# Altium schematic sheet WWOL.SchDoc
size A4; SheetNumber: 1; SheetTotal: 1
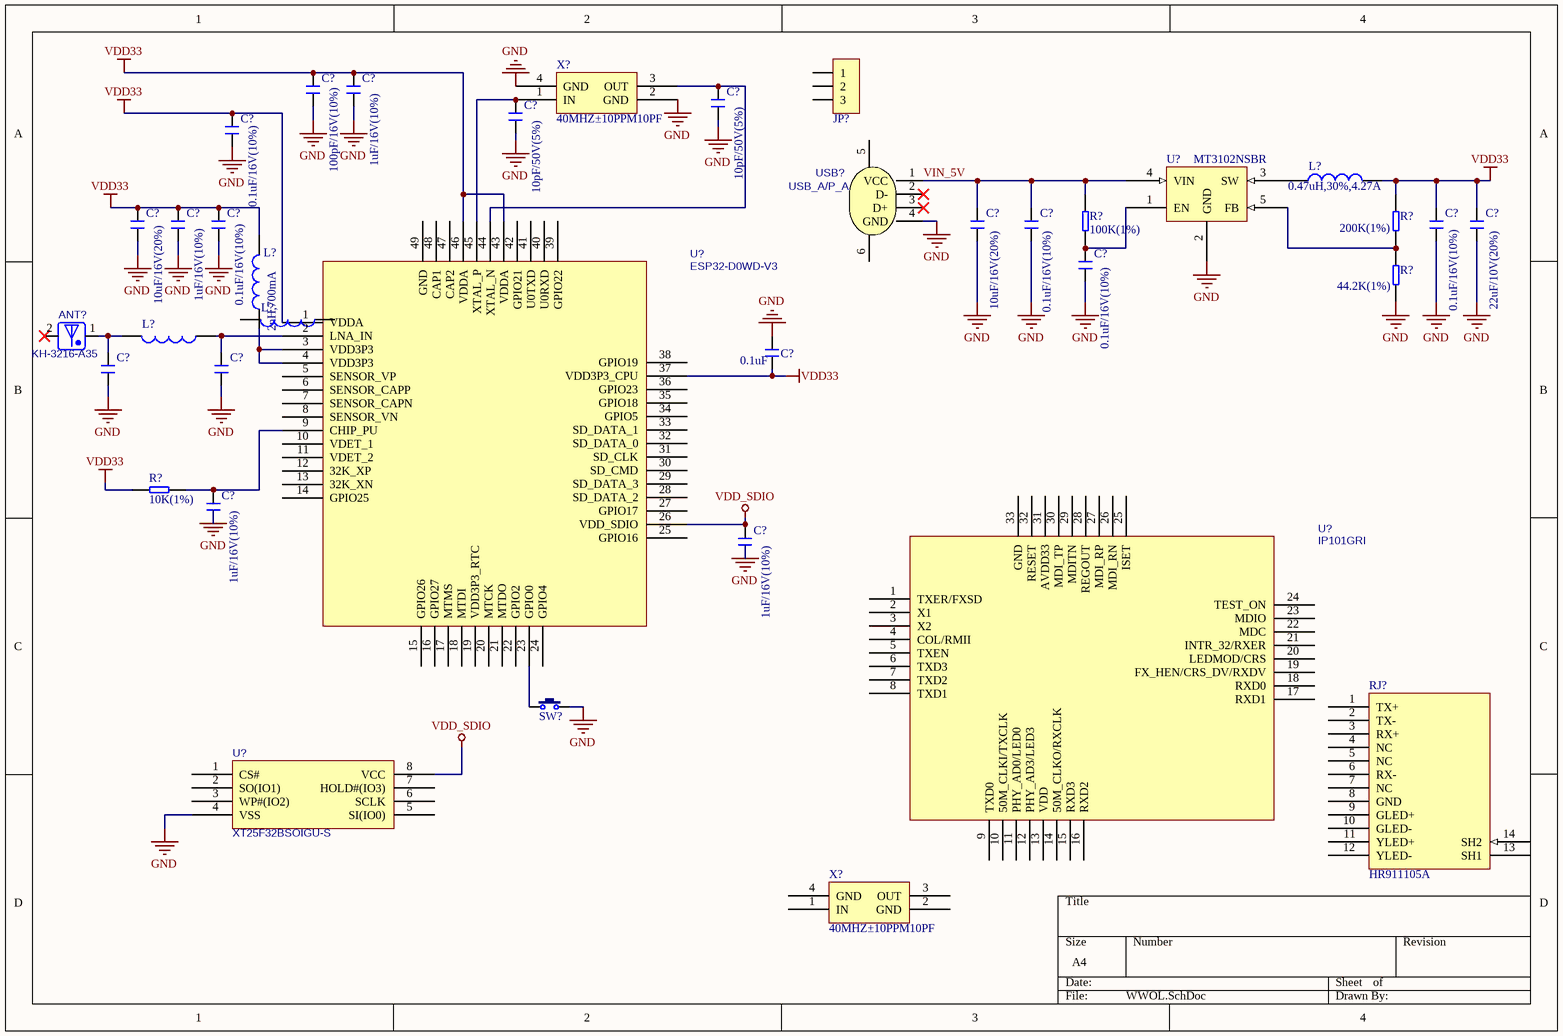
[diagram p0: WWOL.SchDoc]

## Parts
(Parts that share a designator on the sheet are numbered #1, #2 ... from top to bottom, then left to right.)
ANT?  KH-3216-A35  [ANT-SMD-2_L3.2-W1.6-C504002]
C?#1  100pF/16V(10%)  [C0402]
C?#2  1uF/16V(10%)  [C0402]
C?#3  10pF/50V(5%)  [C0402]
C?#4  10pF/50V(5%)  [C0402]
C?#5  0.1uF/16V(10%)  [C0402]
C?#6  10uF/16V(20%)  [C0402]
C?#7  1uF/16V(10%)  [C0402]
C?#8  0.1uF/16V(10%)  [C0402]
C?#9  10uF/16V(20%)  [C0402]
C?#10  0.1uF/16V(10%)  [C0402]
C?#11  0.1uF/16V(10%)  [C0402]
C?#12  22uF/10V(20%)  [C0402]
C?#13  0.1uF/16V(10%)  [C0402]
C?#14  0.1uF  [C0402]
C?#15  (no value)  [C0402]
C?#16  (no value)  [C0402]
C?#17  1uF/16V(10%)  [C0402]
C?#18  1uF/16V(10%)  [C0402]
JP?  HDR-1X3  [HDR2.54-LI-3P]  (value not drawn)
L?#1  0.47uH,30%,4.27A  [L0402]
L?#2  (no value)  [L0402]
L?#3  2nH,700mA  [L0402]
L?#4  (no value)  [L0402]
R?#1  100K(1%)  [R0402]
R?#2  200K(1%)  [R0402]
R?#3  44.2K(1%)  [R0402]
R?#4  10K(1%)  [R0402]
RJ?  HR911105A  [RJ-45A12]
SW?  3x6x5  [TSW SMD-3*6*2.5]  (value not drawn)
U?#1  MT3102NSBR  [SOT95P280X145-5N]
U?#2  ESP32-D0WD-V3  [QFN35P500X500X90_HS-49N]
U?#3  IP101GRI  [QFN35P500X500X90_HS-49N]
U?#4  XT25F32BSOIGU-S  [SOP127P600X175-8N]
USB?  USB_A/P_A  [USB_A/P_A]
X?#1  40MHZ±10PPM10PF  [OSC 1612-4P]
X?#2  40MHZ±10PPM10PF  [OSC 1612-4P]

## Nets
GND: C?#1.1 C?#2.1 C?#3.1 C?#4.1 C?#5.1 C?#6.1 C?#7.1 C?#8.1 C?#9.1 C?#10.1 C?#11.1 C?#12.1 C?#13.1 C?#14.1 C?#15.1 C?#16.1 C?#17.1 C?#18.1 R?#3.1 SW?.2 U?#1.2(GND) U?#4.4(VSS) USB?.4(GND) X?#1.2(GND) X?#1.4(GND)
VDD33: C?#1.2 C?#2.2 C?#5.2 C?#6.2 C?#7.2 C?#8.2 C?#11.2 C?#12.2 C?#14.2 L?#1.2 L?#3.2 R?#2.2 R?#4.2 U?#2.1(VDDA) U?#2.37(VDD3P3_CPU) U?#2.43(VDDA) U?#2.46(VDDA)
VDD_SDIO: C?#18.2 U?#2.26(VDD_SDIO) U?#4.8(VCC)
VIN_5V: C?#9.2 C?#10.2 R?#1.2 U?#1.4(VIN) USB?.1(VCC)
NetANT?_1: ANT?.1 C?#15.2 L?#4.2
NetC?#3_2: C?#3.2 U?#2.44(XTAL_N) X?#1.3(OUT)
NetC?#4_2: C?#4.2 U?#2.45(XTAL_P) X?#1.1(IN)
NetC?#13_2: C?#13.2 R?#1.1 U?#1.1(EN)
NetC?#16_2: C?#16.2 L?#4.1 U?#2.2(LNA_IN)
NetC?#17_2: C?#17.2 R?#4.1 U?#2.9(CHIP_PU)
NetL?#1_1: L?#1.1 U?#1.3(SW)
NetL?#3_1: L?#3.1 U?#2.3(VDD3P3) U?#2.4(VDD3P3)
NetR?#2_1: R?#2.1 R?#3.2 U?#1.5(FB)
NetSW?_1: SW?.1 U?#2.23(GPIO0)

Not connected (* = marked no-connect by the designer): ANT? 2*; JP? 1 2 3; L?#2 1 2; RJ? 1(TX+) 2(TX-) 3(RX+) 4(NC) 5(NC) 6(RX-) 7(NC) 8(GND) 9(GLED+) 10(GLED-) 11(YLED+) 12(YLED-) 13(SH1) 14(SH2); U?#2 5(SENSOR_VP) 6(SENSOR_CAPP) 7(SENSOR_CAPN) 8(SENSOR_VN) 10(VDET_1) 11(VDET_2) 12(32K_XP) 13(32K_XN) 14(GPIO25) 15(GPIO26) 16(GPIO27) 17(MTMS) 18(MTDI) 19(VDD3P3_RTC) 20(MTCK) 21(MTDO) 22(GPIO2) 24(GPIO4) 25(GPIO16) 27(GPIO17) 28(SD_DATA_2) 29(SD_DATA_3) 30(SD_CMD) 31(SD_CLK) 32(SD_DATA_0) 33(SD_DATA_1) 34(GPIO5) 35(GPIO18) 36(GPIO23) 38(GPIO19) 39(GPIO22) 40(U0RXD) 41(U0TXD) 42(GPIO21) 47(CAP2) 48(CAP1) 49(GND); U?#3 1(TXER/FXSD) 2(X1) 3(X2) 4(COL/RMII) 5(TXEN) 6(TXD3) 7(TXD2) 8(TXD1) 9(TXD0) 10(50M_CLKI/TXCLK) 11(PHY_AD0/LED0) 12(PHY_AD3/LED3) 13(VDD) 14(50M_CLKO/RXCLK) 15(RXD3) 16(RXD2) 17(RXD1) 18(RXD0) 19(FX_HEN/CRS_DV/RXDV) 20(LEDMOD/CRS) 21(INTR_32/RXER) 22(MDC) 23(MDIO) 24(TEST_ON) 25(ISET) 26(MDI_RN) 27(MDI_RP) 28(REGOUT) 29(MDITN) 30(MDI_TP) 31(AVDD33) 32(RESET) 33(GND); U?#4 1(CS#) 2(SO(IO1)) 3(WP#(IO2)) 5(SI(IO0)) 6(SCLK) 7(HOLD#(IO3)); USB? 2(D-)* 3(D+)* 5 6; X?#2 1(IN) 2(GND) 3(OUT) 4(GND)

## Library data of the parts
ANT? = KH-3216-A35: 金航标 KH-3216-A35; BOM_Manufacturer: kinghelm(金航标); Contributor: LCSC; BOM_Supplier: LCSC; BOM_Supplier Part: C504002; BOM_Manufacturer Part: KH-3216-A35; BOM_JLCPCB Part Class: Extended Part; spicePre: L; spiceSymbolName: KH-3216-A35
C?#1-C?#18 = C: 无极性贴片电容; 版权归属: 源创客; BOM名称: 无极性贴片电容; 学习资源: www.ooocke.com
JP? = Header 3: 3P接插件; 版权归属: 源创客; BOM名称: 3P接插件; 学习资源: www.ooocke.com
L?#1-L?#4 = L: 小功率贴片电感
R?#1-R?#4 = R: 贴片电阻
RJ? = HR911105A: 带灯以太网接口
SW? = TSW 3x6: 3x6轻触开关; 版权归属: 源创客; BOM名称: 3x6轻触开关; 学习资源: www.ooocke.com
U?#2 = ESP32-D0WD-V3: BOM_Manufacturer: ESPRESSIF 乐鑫; Contributor: LCSC; BOM_Supplier: LCSC; BOM_Supplier Part: C967021; BOM_Manufacturer Part: ESP32-D0WD-V3; BOM_JLCPCB Part Class: Extended Part; Frequency: -; spicePre: U; spiceSymbolName: ESP32-D0WD-V3
U?#3 = IP101GRI: BOM_Manufacturer: IC Plus; Contributor: LCSC; BOM_Supplier: LCSC; BOM_Supplier Part: C703537; BOM_Manufacturer Part: IP101GRI; BOM_JLCPCB Part Class: Extended Part; spicePre: U; spiceSymbolName: IP101GRI
U?#4 = XT25F32BSOIGU-S: spi flash; BOM_Manufacturer: XTX; Contributor: LCSC; BOM_Supplier: LCSC; BOM_Supplier Part: C558851; BOM_Manufacturer Part: XT25F32BSOIGU-S; BOM_JLCPCB Part Class: Extended Part; spicePre: U; spiceSymbolName: XT25F32BSOIGU-S
USB? = USB_A/P_A: BOM_Manufacturer: SOFNG; BOM_Manufacturer Part: USB-07; Contributor: LCSC; BOM_Supplier: LCSC; BOM_Supplier Part: C183610; BOM_JLCPCB Part Class: Extended Part; spicePre: U; spiceSymbolName: USB-07
X?#1 X?#2 = XTAL-4P